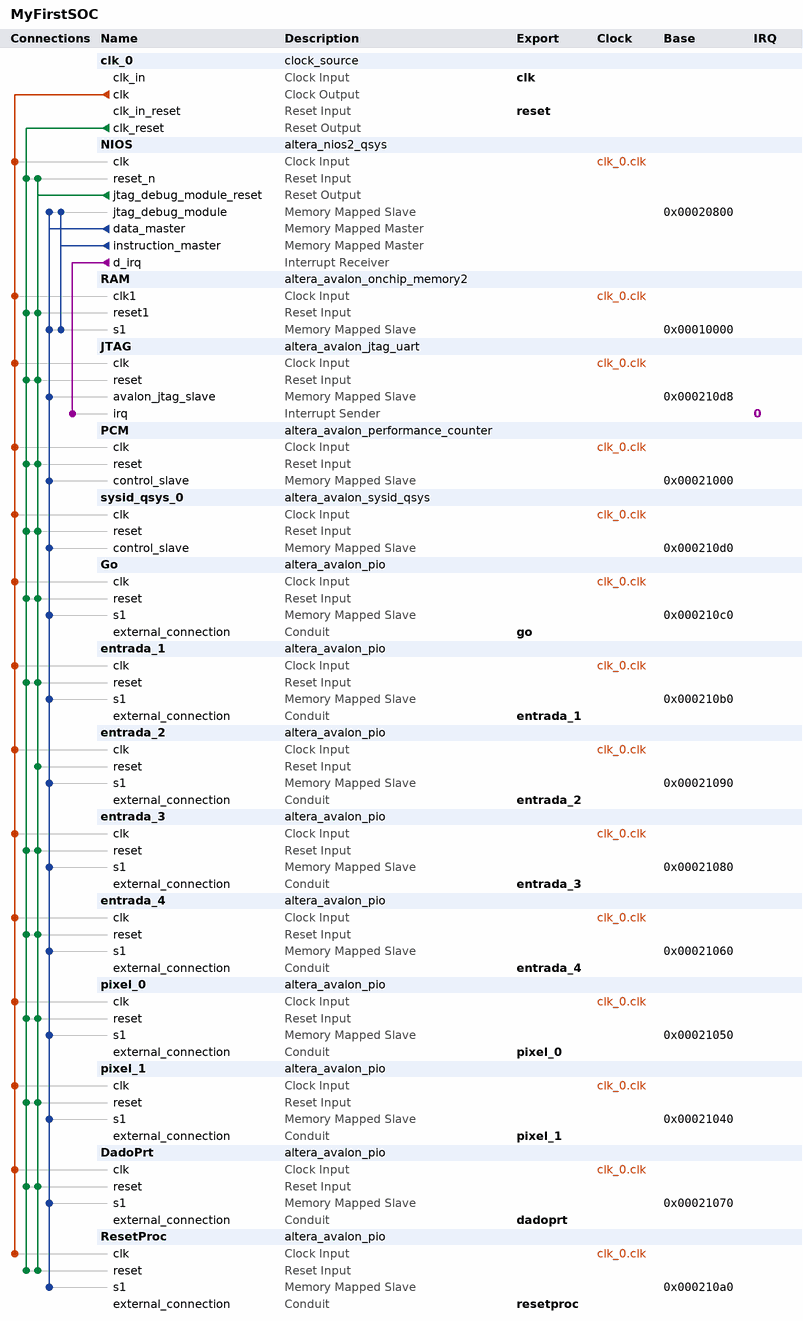
[diagram p0: system contents]
# Platform Designer (Qsys) system MyFirstSOC, Cyclone III EP3C25F324C6
# Parameters at their usual value, and those the tool derives, are not listed.
package require -exact qsys 13.1
create_system MyFirstSOC
set_project_property DEVICE_FAMILY {Cyclone III}
set_project_property DEVICE EP3C25F324C6

add_instance clk_0 clock_source 13.1
set_instance_parameter_value clk_0 clockFrequency 50000000

add_instance NIOS altera_nios2_qsys 13.1
set_instance_parameter_value NIOS resetSlave RAM.s1
set_instance_parameter_value NIOS mmu_TLBMissExcSlave None
set_instance_parameter_value NIOS exceptionSlave RAM.s1
set_instance_parameter_value NIOS breakSlave NIOS.jtag_debug_module
set_instance_parameter_value NIOS impl Tiny
set_instance_parameter_value NIOS icache_size 4096

add_instance RAM altera_avalon_onchip_memory2 13.1
set_instance_parameter_value RAM dataWidth 16
set_instance_parameter_value RAM dualPort false
set_instance_parameter_value RAM initMemContent true
set_instance_parameter_value RAM initializationFileName onchip_mem.hex
set_instance_parameter_value RAM memorySize 40960

add_instance JTAG altera_avalon_jtag_uart 13.1
set_instance_parameter_value JTAG simInteractiveOptions NO_INTERACTIVE_WINDOWS

add_instance PCM altera_avalon_performance_counter 13.1
set_instance_parameter_value PCM numberOfSections 3

add_instance sysid_qsys_0 altera_avalon_sysid_qsys 13.1
set_instance_parameter_value sysid_qsys_0 id 0

add_instance Go altera_avalon_pio 13.1
set_instance_parameter_value Go direction Output
set_instance_parameter_value Go width 1

add_instance entrada_1 altera_avalon_pio 13.1
set_instance_parameter_value entrada_1 direction Output
set_instance_parameter_value entrada_1 width 32

add_instance entrada_2 altera_avalon_pio 13.1
set_instance_parameter_value entrada_2 direction Output
set_instance_parameter_value entrada_2 width 32

add_instance entrada_3 altera_avalon_pio 13.1
set_instance_parameter_value entrada_3 direction Output
set_instance_parameter_value entrada_3 width 32

add_instance entrada_4 altera_avalon_pio 13.1
set_instance_parameter_value entrada_4 direction Output
set_instance_parameter_value entrada_4 width 32

add_instance pixel_0 altera_avalon_pio 13.1
set_instance_parameter_value pixel_0 direction Input
set_instance_parameter_value pixel_0 width 8

add_instance pixel_1 altera_avalon_pio 13.1
set_instance_parameter_value pixel_1 direction Input
set_instance_parameter_value pixel_1 width 8

add_instance DadoPrt altera_avalon_pio 13.1
set_instance_parameter_value DadoPrt direction Input
set_instance_parameter_value DadoPrt width 1

add_instance ResetProc altera_avalon_pio 13.1
set_instance_parameter_value ResetProc direction Output
set_instance_parameter_value ResetProc width 1

# connections
add_connection clk_0.clk DadoPrt.clk clock
add_connection clk_0.clk entrada_1.clk clock
add_connection clk_0.clk entrada_2.clk clock
add_connection clk_0.clk entrada_3.clk clock
add_connection clk_0.clk entrada_4.clk clock
add_connection clk_0.clk Go.clk clock
add_connection clk_0.clk JTAG.clk clock
add_connection clk_0.clk NIOS.clk clock
add_connection clk_0.clk PCM.clk clock
add_connection clk_0.clk pixel_0.clk clock
add_connection clk_0.clk pixel_1.clk clock
add_connection clk_0.clk RAM.clk1 clock
add_connection clk_0.clk ResetProc.clk clock
add_connection clk_0.clk sysid_qsys_0.clk clock
add_connection clk_0.clk_reset DadoPrt.reset reset
add_connection clk_0.clk_reset entrada_1.reset reset
add_connection clk_0.clk_reset entrada_3.reset reset
add_connection clk_0.clk_reset entrada_4.reset reset
add_connection clk_0.clk_reset Go.reset reset
add_connection clk_0.clk_reset JTAG.reset reset
add_connection clk_0.clk_reset NIOS.reset_n reset
add_connection clk_0.clk_reset PCM.reset reset
add_connection clk_0.clk_reset pixel_0.reset reset
add_connection clk_0.clk_reset pixel_1.reset reset
add_connection clk_0.clk_reset RAM.reset1 reset
add_connection clk_0.clk_reset ResetProc.reset reset
add_connection clk_0.clk_reset sysid_qsys_0.reset reset
add_connection NIOS.jtag_debug_module_reset DadoPrt.reset reset
add_connection NIOS.jtag_debug_module_reset entrada_1.reset reset
add_connection NIOS.jtag_debug_module_reset entrada_2.reset reset
add_connection NIOS.jtag_debug_module_reset entrada_3.reset reset
add_connection NIOS.jtag_debug_module_reset entrada_4.reset reset
add_connection NIOS.jtag_debug_module_reset Go.reset reset
add_connection NIOS.jtag_debug_module_reset JTAG.reset reset
add_connection NIOS.jtag_debug_module_reset NIOS.reset_n reset
add_connection NIOS.jtag_debug_module_reset PCM.reset reset
add_connection NIOS.jtag_debug_module_reset pixel_0.reset reset
add_connection NIOS.jtag_debug_module_reset pixel_1.reset reset
add_connection NIOS.jtag_debug_module_reset RAM.reset1 reset
add_connection NIOS.jtag_debug_module_reset ResetProc.reset reset
add_connection NIOS.jtag_debug_module_reset sysid_qsys_0.reset reset
add_connection NIOS.data_master DadoPrt.s1 avalon
set_connection_parameter_value NIOS.data_master/DadoPrt.s1 baseAddress 0x00021070
add_connection NIOS.data_master entrada_1.s1 avalon
set_connection_parameter_value NIOS.data_master/entrada_1.s1 baseAddress 0x000210b0
add_connection NIOS.data_master entrada_2.s1 avalon
set_connection_parameter_value NIOS.data_master/entrada_2.s1 baseAddress 0x00021090
add_connection NIOS.data_master entrada_3.s1 avalon
set_connection_parameter_value NIOS.data_master/entrada_3.s1 baseAddress 0x00021080
add_connection NIOS.data_master entrada_4.s1 avalon
set_connection_parameter_value NIOS.data_master/entrada_4.s1 baseAddress 0x00021060
add_connection NIOS.data_master Go.s1 avalon
set_connection_parameter_value NIOS.data_master/Go.s1 baseAddress 0x000210c0
add_connection NIOS.data_master JTAG.avalon_jtag_slave avalon
set_connection_parameter_value NIOS.data_master/JTAG.avalon_jtag_slave baseAddress 0x000210d8
add_connection NIOS.data_master NIOS.jtag_debug_module avalon
set_connection_parameter_value NIOS.data_master/NIOS.jtag_debug_module baseAddress 0x00020800
add_connection NIOS.data_master PCM.control_slave avalon
set_connection_parameter_value NIOS.data_master/PCM.control_slave baseAddress 0x00021000
add_connection NIOS.data_master pixel_0.s1 avalon
set_connection_parameter_value NIOS.data_master/pixel_0.s1 baseAddress 0x00021050
add_connection NIOS.data_master pixel_1.s1 avalon
set_connection_parameter_value NIOS.data_master/pixel_1.s1 baseAddress 0x00021040
add_connection NIOS.data_master RAM.s1 avalon
set_connection_parameter_value NIOS.data_master/RAM.s1 baseAddress 0x00010000
add_connection NIOS.data_master ResetProc.s1 avalon
set_connection_parameter_value NIOS.data_master/ResetProc.s1 baseAddress 0x000210a0
add_connection NIOS.data_master sysid_qsys_0.control_slave avalon
set_connection_parameter_value NIOS.data_master/sysid_qsys_0.control_slave baseAddress 0x000210d0
add_connection NIOS.instruction_master NIOS.jtag_debug_module avalon
set_connection_parameter_value NIOS.instruction_master/NIOS.jtag_debug_module baseAddress 0x00020800
add_connection NIOS.instruction_master RAM.s1 avalon
set_connection_parameter_value NIOS.instruction_master/RAM.s1 baseAddress 0x00010000
add_connection NIOS.d_irq JTAG.irq interrupt
set_connection_parameter_value NIOS.d_irq/JTAG.irq irqNumber 0

# exported interfaces
add_interface clk clock sink
set_interface_property clk EXPORT_OF clk_0.clk_in
add_interface reset reset sink
set_interface_property reset EXPORT_OF clk_0.clk_in_reset
add_interface entrada_1 conduit end
set_interface_property entrada_1 EXPORT_OF entrada_1.external_connection
add_interface go conduit end
set_interface_property go EXPORT_OF Go.external_connection
add_interface resetproc conduit end
set_interface_property resetproc EXPORT_OF ResetProc.external_connection
add_interface entrada_3 conduit end
set_interface_property entrada_3 EXPORT_OF entrada_3.external_connection
add_interface entrada_2 conduit end
set_interface_property entrada_2 EXPORT_OF entrada_2.external_connection
add_interface dadoprt conduit end
set_interface_property dadoprt EXPORT_OF DadoPrt.external_connection
add_interface entrada_4 conduit end
set_interface_property entrada_4 EXPORT_OF entrada_4.external_connection
add_interface pixel_0 conduit end
set_interface_property pixel_0 EXPORT_OF pixel_0.external_connection
add_interface pixel_1 conduit end
set_interface_property pixel_1 EXPORT_OF pixel_1.external_connection

set_interconnect_requirement {$system} qsys_mm.clockCrossingAdapter HANDSHAKE
set_interconnect_requirement {$system} qsys_mm.maxAdditionalLatency 1
set_interconnect_requirement {$system} qsys_mm.insertDefaultSlave false

save_system MyFirstSOC.qsys
